# Altium schematic sheet Power.SchDoc
size A4; Date: *******; ApprovedBy: *******; CheckedBy: None; Author: *******; CompanyName: *******; DrawnBy: Name; Engineer: *******; Organization: *******; Address1: *******; Address2: *******; Address3: *******; Address4: *******; DocumentNumber: Doc Num; Revision: *******; SheetNumber: 2; SheetTotal: 4; CurrentTime: *******; CurrentDate: *******; Time: *******; DocumentFullPathAndName: *******; DocumentName: *******; ModifiedDate: *******; ImagePath: *******; ProjectName: *******; Application_BuildNumber: *******
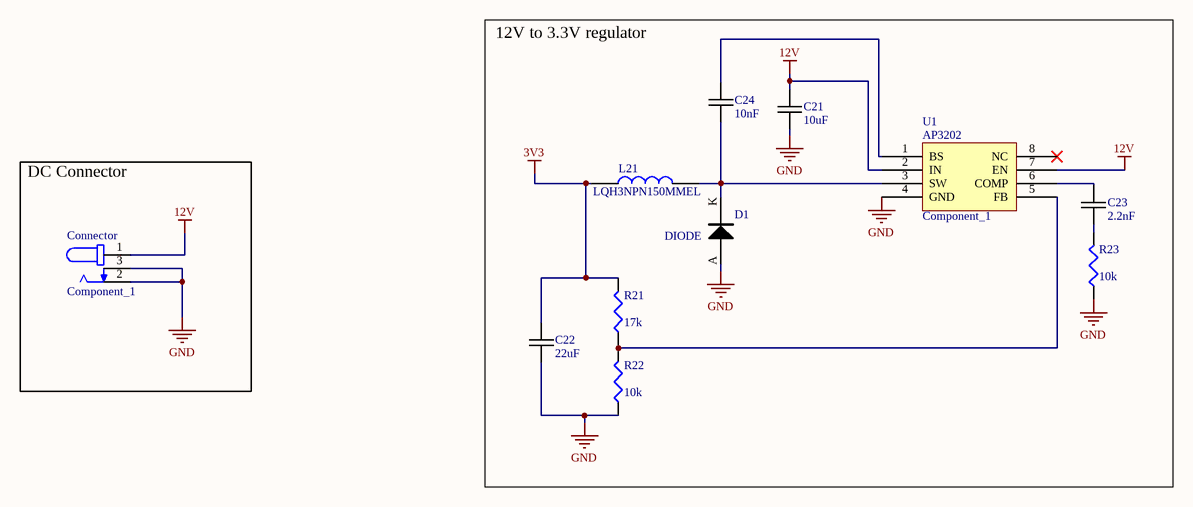
[diagram p0: Power.SchDoc]

## Parts
C21  10uF  [0603C-GENERIC]
C22  22uF  [0603C-GENERIC]
C23  2.2nF  [0603C-GENERIC]
C24  10nF  [0603C-GENERIC]
Connector  Component_1  [PCBComponent_1]
D1  DIODE  [RESC2012X65N]
L21  LQH3NPN150MMEL  [IND_LQH3NPH3R3MMEL]
R21  value 17k  [J1-0603]
R22  value 10k  [J1-0603]
R23  value 10k  [J1-0603]
U1  Component_1  [AP3202]

## Blocks framed on the sheet
12V to 3.3V regulator: C21-C24 D1 L21 R21-R23 U1
DC Connector: Connector

## Nets
3V3: C22.1 L21.1 R21.2
12V: C21.1 Connector.1 U1.2(IN) U1.7(EN)
GND: C21.2 C22.2 Connector.2 Connector.3 D1.A R22.1 R23.1 U1.4(GND)
NetC23_1: C23.1 U1.6(COMP)
NetC23_2: C23.2 R23.2
NetC24_1: C24.1 U1.1(BS)
NetC24_2: C24.2 D1.K L21.2 U1.3(SW)
NetR21_1: R21.1 R22.2 U1.5(FB)

Not connected (* = marked no-connect by the designer): U1 8(NC)*

## Notes on the sheet
- Title:
- Drawn By:
- Page Contents:
- Checked By:
- Size:
- Date:
- File:
- License:
- Email:
- A4
- Number:
- Time:
- Revision:
- Sheet
- Website:
- of
- (in symbol Component_1) AP3202

## Library data of the parts
C21-C24 = C0603-GENERIC: GENERIC CAPACITOR NON POLARISED 0603
D1 = DIODE-GENERIC: GENERIC DIODE
L21 = LQH3NPH3R3MMEL: Inductor with Inductance 3.3uH Tol.+/-20% Package 1212 (3030); MF: Murata; Check_prices: https://www.snapeda.com/parts/LQH3NPH3R3MMEL/Murata/view-part/4970388/?ref=eda; Digi-Key_Part_Number: 490-LQH3NPH3R3MMELCT-ND; Package: 1212 Murata; MP: LQH3NPH3R3MMEL; Value: *; SnapEDA_Link: https://www.snapeda.com/parts/LQH3NPH3R3MMEL/Murata/view-part/4970388/?ref=snap; Purchase-URL: https://pricing.snapeda.com/search/part/LQH3NPH3R3MMEL/?ref=eda
R21-R23 = Res3: Resistor; Published: 8-Jun-2000; LatestRevisionDate: 29-May-2009; LatestRevisionNote: IPC-7351 Footprint Added.; PackageReference: J1-0603; Publisher: Altium Limited; PackageDescription: Chip Resistor